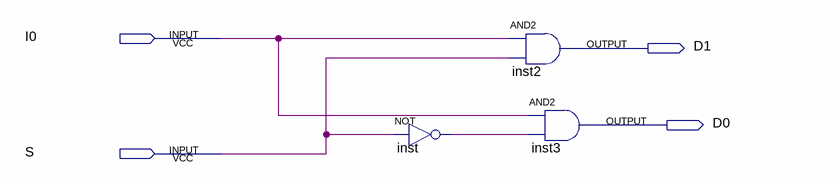
[diagram p0: schematic sheet]
// Quartus schematic DM2PX.bdf as structural Verilog: 3 symbols, 4 pins
module DM2PX (
  input  I0,
  input  S,
  output D1,
  output D0
);

  wire inst_out;

  not inst (inst_out, S);
  and inst2 (D1, I0, S);
  and inst3 (D0, I0, inst_out);
endmodule
